# EAGLE design cube bottom 3 (EAGLE 9.5.1)
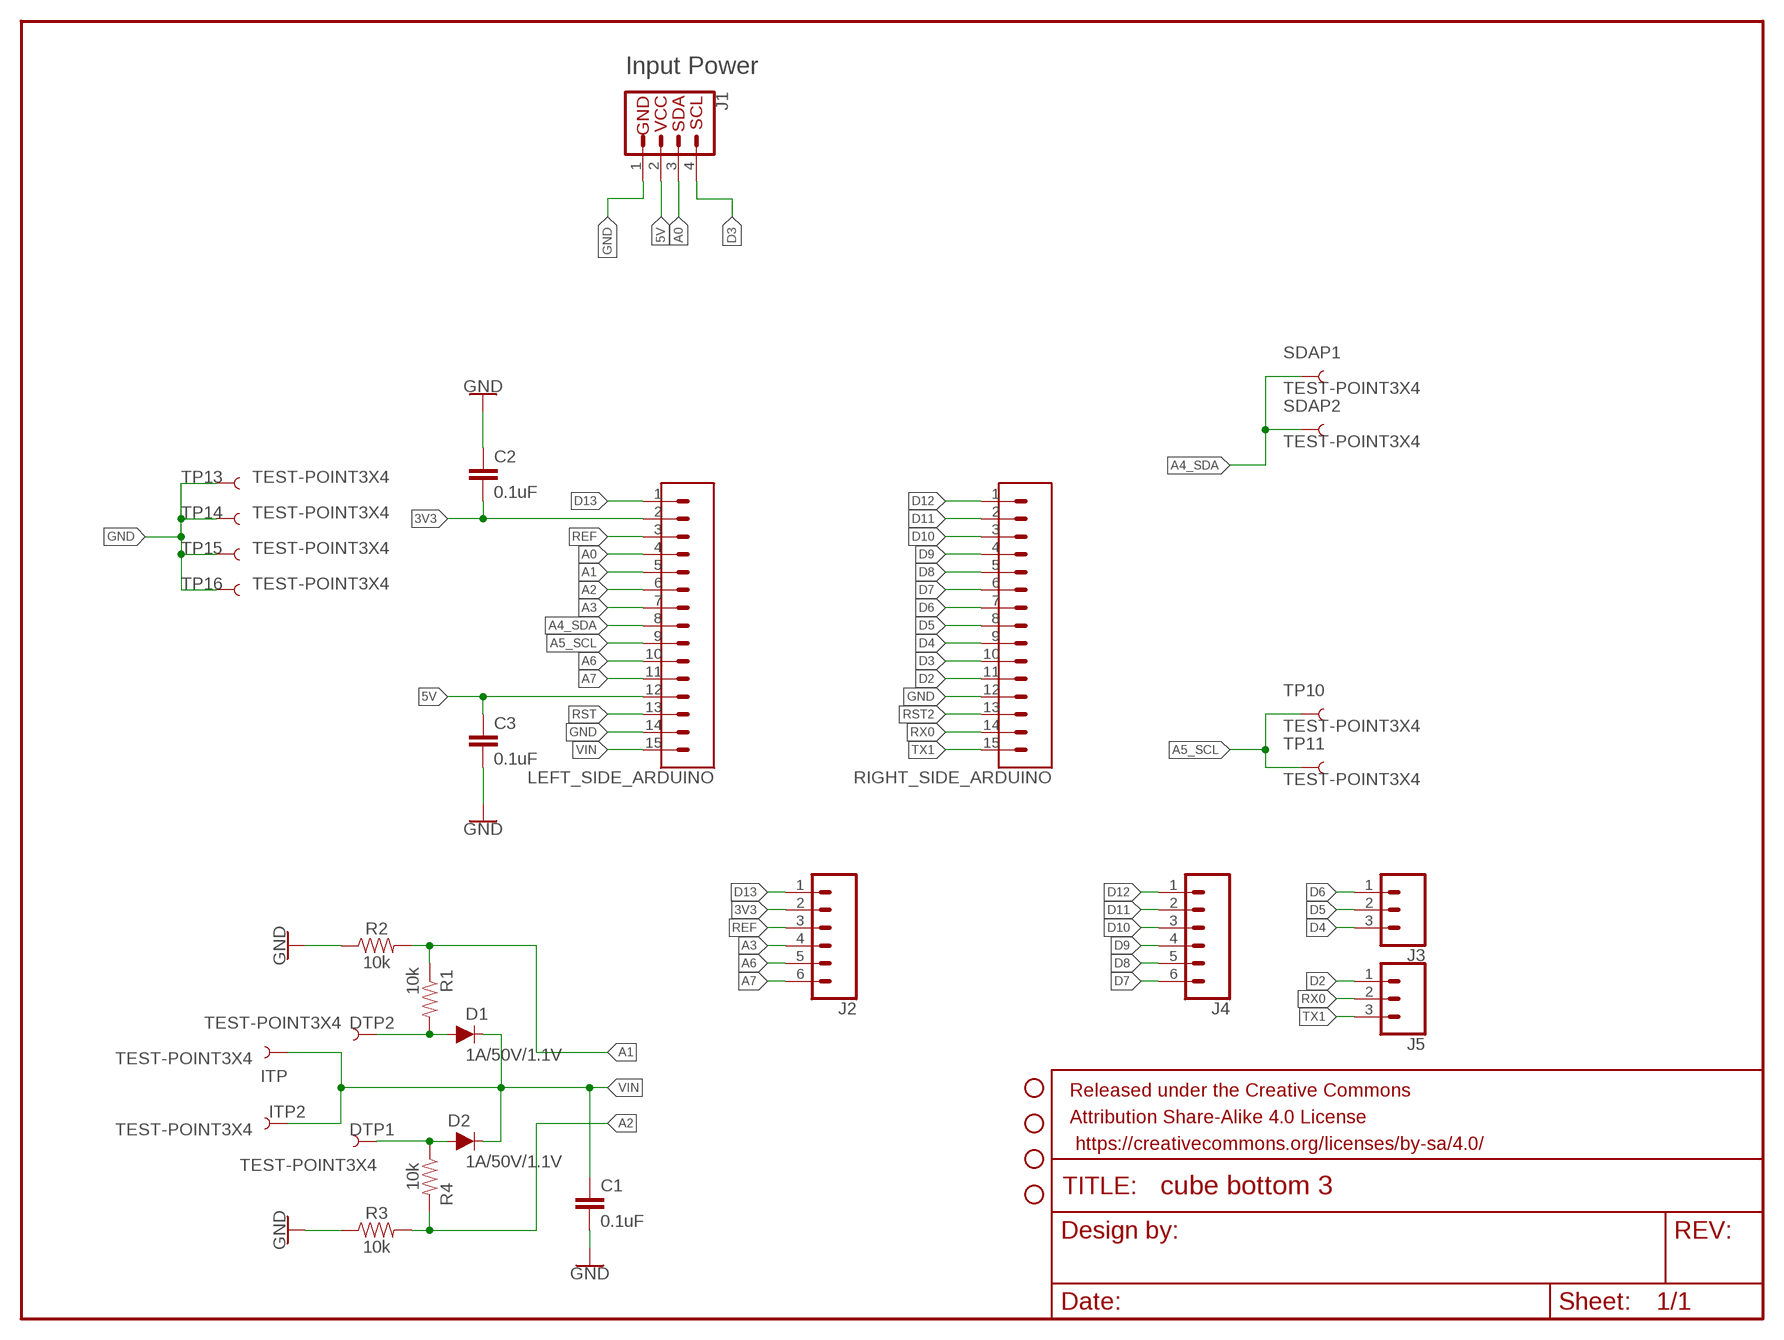
[diagram p0: schematic, sheet 1]

## Parts
C1  0.1uF  0.1UF-0603-25V-5%  [0603]
C2  0.1uF  0.1UF-0603-25V-(+80/-20%)  [0603]
C3  0.1uF  0.1UF-0603-25V-(+80/-20%)  [0603]
D1  1A/50V/1.1V  DIODE-PTH  [DIODE-1N4001]
D2  1A/50V/1.1V  DIODE-PTH  [DIODE-1N4001]
DTP1  TEST-POINT3X4  [PAD.03X.04]
DTP2  TEST-POINT3X4  [PAD.03X.04]
FRAME1  FRAME-LETTERNO_PACKAGE  [DUMMY]
H1  STAND-OFF  [STAND-OFF]
H2  STAND-OFF  [STAND-OFF]
H3  STAND-OFF  [STAND-OFF]
H4  STAND-OFF  [STAND-OFF]
ITP  TEST-POINT3X4  [PAD.03X.04]
ITP2  TEST-POINT3X4  [PAD.03X.04]
J1  QWIIC_CONNECTORJS-1MM  [1X04_1MM_RA]
J2  CONN_06SILK_FEMALE_PTH  [1X06]
J3  CONN_03  [1X03]
J4  CONN_06SILK_FEMALE_PTH  [1X06]
J5  CONN_03  [1X03]
LEFT_SIDE_ARDUINO  CONN_06SMD_MALE  [1X15_SMD_MALE]
R1  10k  10KOHM-0603-1/10W-1%  [0603]
R2  10k  10KOHM-0603-1/10W-1%  [0603]
R3  10k  10KOHM-0603-1/10W-1%  [0603]
R4  10k  10KOHM-0603-1/10W-1%  [0603]
RIGHT_SIDE_ARDUINO  CONN_06SMD_MALE  [1X15_SMD_MALE]
SDAP1  TEST-POINT3X4  [PAD.03X.04]
SDAP2  TEST-POINT3X4  [PAD.03X.04]
TP10  TEST-POINT3X4  [PAD.03X.04]
TP11  TEST-POINT3X4  [PAD.03X.04]
TP13  TEST-POINT3X4  [PAD.03X.04]
TP14  TEST-POINT3X4  [PAD.03X.04]
TP15  TEST-POINT3X4  [PAD.03X.04]
TP16  TEST-POINT3X4  [PAD.03X.04]

## Nets
3V3: C2.2 J2.2 LEFT_SIDE_ARDUINO.2
5V: C3.1 J1.2(VCC) LEFT_SIDE_ARDUINO.12
A0: J1.3(SDA) LEFT_SIDE_ARDUINO.4
A1: LEFT_SIDE_ARDUINO.5 R1.1 R2.2
A2: LEFT_SIDE_ARDUINO.6 R3.2 R4.2
A3: J2.4 LEFT_SIDE_ARDUINO.7
A4_SDA: LEFT_SIDE_ARDUINO.8 SDAP1.P$1 SDAP2.P$1
A5_SCL: LEFT_SIDE_ARDUINO.9 TP10.P$1 TP11.P$1
A6: J2.5 LEFT_SIDE_ARDUINO.10
A7: J2.6 LEFT_SIDE_ARDUINO.11
D2: J5.1 RIGHT_SIDE_ARDUINO.11
D3: J1.4(SCL) RIGHT_SIDE_ARDUINO.10
D4: J3.3 RIGHT_SIDE_ARDUINO.9
D5: J3.2 RIGHT_SIDE_ARDUINO.8
D6: J3.1 RIGHT_SIDE_ARDUINO.7
D7: J4.6 RIGHT_SIDE_ARDUINO.6
D8: J4.5 RIGHT_SIDE_ARDUINO.5
D9: J4.4 RIGHT_SIDE_ARDUINO.4
D10: J4.3 RIGHT_SIDE_ARDUINO.3
D11: J4.2 RIGHT_SIDE_ARDUINO.2
D12: J4.1 RIGHT_SIDE_ARDUINO.1
D13: J2.1 LEFT_SIDE_ARDUINO.1
DTP1: D2.A DTP1.P$1 R4.1
DTP2: D1.A DTP2.P$1 R1.2
GND: C1.2 C2.1 C3.2 J1.1(GND) LEFT_SIDE_ARDUINO.14 R2.1 R3.1 RIGHT_SIDE_ARDUINO.12 TP13.P$1 TP14.P$1 TP15.P$1 TP16.P$1
REF: J2.3 LEFT_SIDE_ARDUINO.3
RST: LEFT_SIDE_ARDUINO.13
RST2: RIGHT_SIDE_ARDUINO.13
RX0: J5.2 RIGHT_SIDE_ARDUINO.14
TX1: J5.3 RIGHT_SIDE_ARDUINO.15
VIN: C1.1 D1.C D2.C ITP2.P$1 ITP.P$1 LEFT_SIDE_ARDUINO.15

## Notes on the sheet
- Input Power

## Library data of the parts
C1 = SparkFun-Capacitors:0.1UF: 0.1µF ceramic capacitors A capacitor is a passive two-terminal electrical component used to store electrical energy temporarily in an electric field.; PROD_ID: CAP-08604
C2 C3 = SparkFun-Capacitors:0.1UF: 0.1µF ceramic capacitors A capacitor is a passive two-terminal electrical component used to store electrical energy temporarily in an electric field.; PROD_ID: CAP-00810
D1 D2 = SparkFun-DiscreteSemi:DIODE: Diode These are standard reverse protection diodes and small signal diodes. SparkFun Products: SparkFun SparkPunk Sound Kit <https://www.sparkfun.com/products/11177> SparkFun ESP8266 Thing <https://www.sparkfun.com/products/13231>; PROD_ID: DIO-09176
DTP1 DTP2 ITP ITP2 SDAP1 SDAP2 TP10 TP11 TP13-TP16 = SparkFun-Connectors:TEST-POINT: SparkFun Test Points Bare copper test points for troubleshooting or In-Circuit-Testing. These are used by our Production team for verifying production board runs using pogo-pins on test beds. SparkFun Products: SparkFun LSM9DS1 Breakout <https://www.sparkfun.com/products/13284> SparkFun PSOC <https://www.sparkfun.com/products/13714> SparkFun Load Cell Amplifier <https://www.sparkfun.com/products/13879>
FRAME1 = SparkFun-Aesthetics:FRAME-LETTER: Schematic Frame - Letter Standard 8.5x11 US Letter frame; DESIGNER: Nobody; VERSION: v01
H1-H4 = SparkFun-Hardware:STAND-OFF: Stand Off Drill holes for mechanically mounting via screws, standoffs, etc. Note: Use the keepout ring to avoid running the screw head into surrounding components. Variant Overviews STAND-OFF - Mechanical footprint for a #4 phillips button head screw. STAND-OFF-TIGHT - Mechanical footprint for a #4 phillips button head screw, Example SparkFun Products Screw - Phillips Head (1/4", 4-40, 10 pack) <https://www.sparkfun.com/products/10453> (PRT-10453) Screw - Phillips Head (1/2", 4-40, 10 pack) <https://www.sparkfun.com/products/10452> (PRT-10452) Screw - Phillips Head (3/4", 4-40, 10 pack) <https://www.sparkfun.com/products/10451> (PRT-10451) Screw - Phillips Head (1", 4-40, 10 pack) <https://www.sparkfun.com/products/10450> (PRT-10450)
J1 = SparkFun-Connectors:QWIIC_CONNECTOR: SparkFun I2C Standard Qwiic Connector An SMD 1mm pitch JST connector makes it easy and quick (get it? Qwiic?) to connect I2C devices to each other. The Qwiic system <http://www.sparkfun.com/qwiic> enables fast and solderless connection between popular platforms and various sensors and actuators. We carry 200mm <https://www.sparkfun.com/products/14204>, 100mm <https://www.sparkfun.com/products/14205>, 50mm <https://www.sparkfun.com/products/14206>, and breadboard friendly <https://www.sparkfun.com/products/14207> Qwiic cables. We also offer 10 pcs strips <https://www.sparkfun.com/products/14323> the SMD connectors.
J2 J4 = SparkFun-Connectors:CONN_06: Multi connection point. Often used as Generic Header-pin footprint for 0.1 inch spaced/style header connections On any of the 0.1 inch spaced packages, you can populate with these: Break Away Headers - Straight <https://www.sparkfun.com/products/116> (PRT-00116) Break Away Male Headers - Right Angle <https://www.sparkfun.com/products/553> (PRT-00553) Female Headers <https://www.sparkfun.com/products/115> (PRT-00115) Break Away Headers - Machine Pin <https://www.sparkfun.com/products/117> (PRT-00117) Break Away Female Headers - Swiss Machine Pin <https://www.sparkfun.com/products/743> (PRT-00743) Arduino Stackable Header - 6 Pin <https://www.sparkfun.com/products/9280> (PRT-09280) For SCREWTERMINALS and SPRING TERMINALS visit here: Screw Terimnals on SparkFun.com <https://www.sparkfun.com/search/results?term=Screw+Terminals> (5mm/3.5mm/2.54mm spacing) This device is also useful as a general connection point to wire up your design to another part of your project. Our various solder wires solder well into these plated through hole pads. Hook-Up Wire - Assortment (Stranded, 22 AWG) <https://www.sparkfun.com/products/11375> (PRT-11375) Hook-Up Wire - Assortment (Solid Core, 22 AWG) <https://www.sparkfun.com/products/11367> (PRT-11367) View the entire wire category on our website here <https://www.sparkfun.com/categories/141>; PROD_ID: CONN-08437
J3 J5 = SparkFun-Connectors:CONN_03: Multi connection point. Often used as Generic Header-pin footprint for 0.1 inch spaced/style header connections On any of the 0.1 inch spaced packages, you can populate with these: Break Away Headers - Straight <https://www.sparkfun.com/products/116> (PRT-00116) Break Away Male Headers - Right Angle <https://www.sparkfun.com/products/553> (PRT-00553) Female Headers <https://www.sparkfun.com/products/115> (PRT-00115) Break Away Headers - Machine Pin <https://www.sparkfun.com/products/117> (PRT-00117) Break Away Female Headers - Swiss Machine Pin <https://www.sparkfun.com/products/743> (PRT-00743) Stackable Header - 3 Pin (Female, 0.1") <https://www.sparkfun.com/products/13875> (PRT-13875) For SCREWTERMINALS and SPRING TERMINALS visit here: Screw Terimnals on SparkFun.com <https://www.sparkfun.com/search/results?term=Screw+Terminals> (5mm/3.5mm/2.54mm spacing) This device is also useful as a general connection point to wire up your design to another part of your project. Our various solder wires solder well into these plated through hole pads. Hook-Up Wire - Assortment (Stranded, 22 AWG) <https://www.sparkfun.com/products/11375> (PRT-11375) Hook-Up Wire - Assortment (Solid Core, 22 AWG) <https://www.sparkfun.com/products/11367> (PRT-11367) View the entire wire category on our website here <https://www.sparkfun.com/categories/141> Special notes: Molex polarized connector foot print use with SKU : PRT-08232 with associated crimp pins and housings.
LEFT_SIDE_ARDUINO RIGHT_SIDE_ARDUINO = capstone footprints:CONN_06: Multi connection point. Often used as Generic Header-pin footprint for 0.1 inch spaced/style header connections On any of the 0.1 inch spaced packages, you can populate with these: Break Away Headers - Straight <https://www.sparkfun.com/products/116> (PRT-00116) Break Away Male Headers - Right Angle <https://www.sparkfun.com/products/553> (PRT-00553) Female Headers <https://www.sparkfun.com/products/115> (PRT-00115) Break Away Headers - Machine Pin <https://www.sparkfun.com/products/117> (PRT-00117) Break Away Female Headers - Swiss Machine Pin <https://www.sparkfun.com/products/743> (PRT-00743) Arduino Stackable Header - 6 Pin <https://www.sparkfun.com/products/9280> (PRT-09280) For SCREWTERMINALS and SPRING TERMINALS visit here: Screw Terimnals on SparkFun.com <https://www.sparkfun.com/search/results?term=Screw+Terminals> (5mm/3.5mm/2.54mm spacing) This device is also useful as a general connection point to wire up your design to another part of your project. Our various solder wires solder well into these plated through hole pads. Hook-Up Wire - Assortment (Stranded, 22 AWG) <https://www.sparkfun.com/products/11375> (PRT-11375) Hook-Up Wire - Assortment (Solid Core, 22 AWG) <https://www.sparkfun.com/products/11367> (PRT-11367) View the entire wire category on our website here <https://www.sparkfun.com/categories/141>; PROD_ID: CONN-11293
R1-R4 = SparkFun-Resistors:10KOHM: 10kΩ resistor A resistor is a passive two-terminal electrical component that implements electrical resistance as a circuit element. Resistors act to reduce current flow, and, at the same time, act to lower voltage levels within circuits. - Wikipedia; PROD_ID: RES-00824

## Board
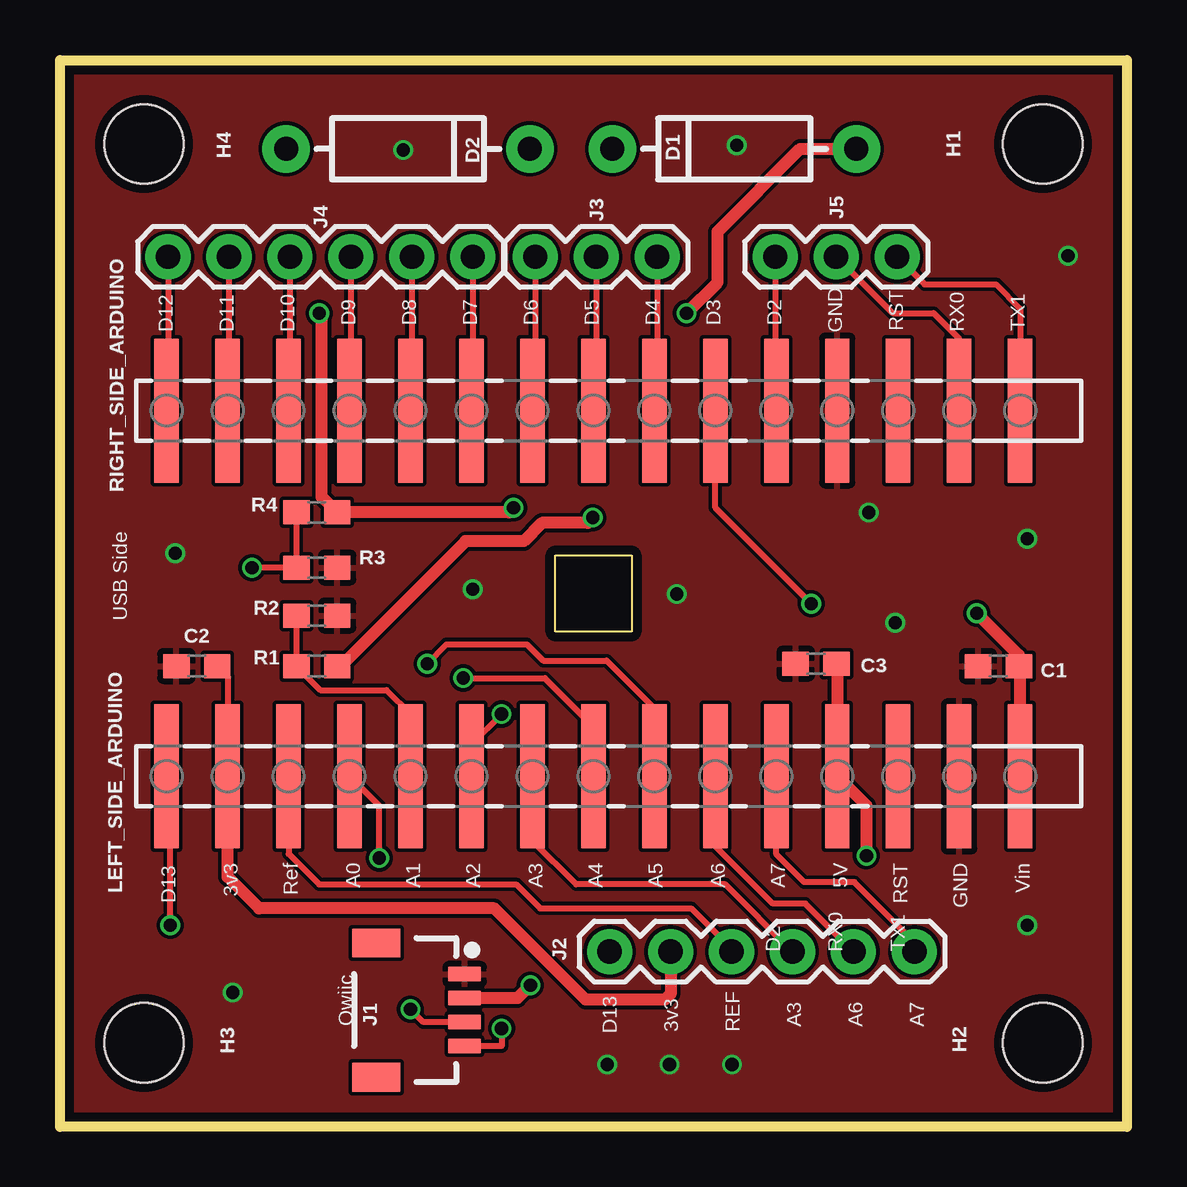
[diagram p1: board, top side]
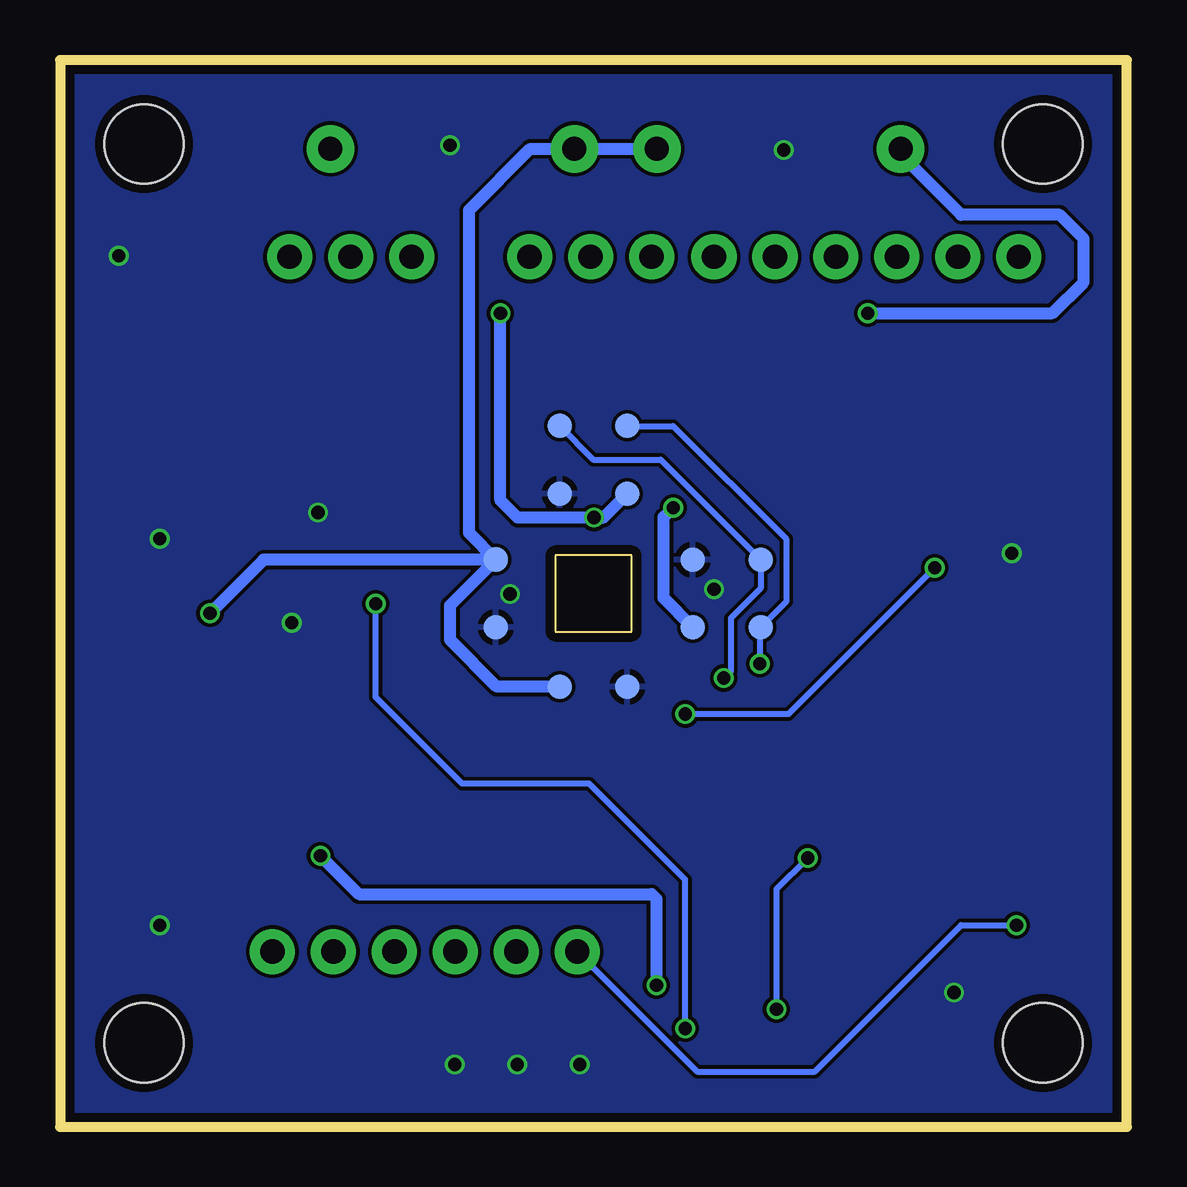
[diagram p2: board, bottom side, seen from below]

Size 44.45 x 44.45 mm. Coordinates in mm from the lower left corner, seen from the top.
Outline: 0,0 0,44.45 44.45,44.45 44.45,0 0,0
Outline: 20.64,23.81 23.81,23.81 23.81,20.64 20.64,20.64 20.64,23.81
Copper layers (1*16): Top 0.035559375mm / dielectric 1.6mm / Bottom 0.035559375mm
Design rules "OSH_2Layer": minimum track width 6mil, minimum drill 10mil, track to track 6mil, track to pad 6mil, pad to pad 6mil, via to via 6mil, smd to smd 6mil, copper to edge 15mil, drill to drill 6mil, minimum pad ring 5mil, minimum via ring 5mil, stop-mask expansion 2.5mil, vias tented up to drill 0mil, thermal gap 10mil

### Footprints (pad centres in the part's own frame; a part is rotated, then mirrored left to right if it is on the bottom)
0603 = smd 1.1 x 1: 1 -0.85,0; 2 0.85,0
DIODE-1N4001 = drill 1 pad 1.981: A -5.08,0; C 5.08,0
PAD.03X.04 = smd 1.016 x 1.016: P$1 0,0
STAND-OFF = hole 3.302: 0,0
1X04_1MM_RA = smd 0.6 x 1.35: 1 -1.5,0; 2 -0.5,0; 3 0.5,0; 4 1.5,0 | smd 1.2 x 2: NC1 2.8,-3.675; NC2 -2.8,-3.675
1X06 = drill 1.016 pad 1.88: 1 0,0; 2 2.54,0; 3 5.08,0; 4 7.62,0; 5 10.16,0; 6 12.7,0
1X03 = drill 1.016 pad 1.88: 1 0,0; 2 2.54,0; 3 5.08,0
1X15_SMD_MALE = smd 1.02 x 6: 1 0,0; 2 2.54,0; 3 5.08,0; 4 7.62,0; 5 10.16,0; 6 12.7,0; 7 15.24,0; 8 17.78,0; 9 20.32,0; 10 22.86,0; 11 25.4,0; 12 27.94,0; 13 30.48,0; 14 33.02,0; 15 35.56,0

### Placement (x,y rotation side)
C1  39.1,19.2 180 top
C2  5.7,19.2 0 top
C3  31.5,19.3 180 top
D1  28.1,40.75 180 top
D2  14.5,40.75 0 top
DTP1  18.08,20.81 0 bottom
DTP2  20.81,26.38 0 bottom
FRAME1  0,0 0 top
H1  40.95,40.95 0 top
H2  40.95,3.5 0 top
H3  3.5,3.5 0 top
H4  3.5,40.95 0 top
ITP  26.29,23.64 0 bottom
ITP2  23.64,18.34 0 bottom
J1  16.86,4.86 270 top
J2  22.9,7.3 0 top
J3  19.8,36.25 0 top
J4  4.5,36.25 0 top
J5  29.8,36.25 0 top
LEFT_SIDE_ARDUINO  4.45,14.61 0 top
R1  10.7,19.2 0 top
R2  10.7,21.3 180 top
R3  10.7,23.3 180 top
R4  10.7,25.6 180 top
RIGHT_SIDE_ARDUINO  4.45,29.84 0 top
SDAP1  23.64,29.2 0 bottom
SDAP2  15.26,23.64 0 bottom
TP10  20.81,29.2 0 bottom
TP11  15.26,20.81 0 bottom
TP13  18.08,23.64 0 bottom
TP14  20.81,18.34 0 bottom
TP15  26.29,20.81 0 bottom
TP16  23.64,26.38 0 bottom

### Tracks (layer width: path | path; a pad name or v marks a point on that pad's centre or on a via)
3V3
  Top 0.254: C2.2 6.99,18.77 LEFT_SIDE_ARDUINO.2
  Top 0.508: J2.2 25.44,5.54 25.2,5.3 21.9,5.3 18.1,9.1 8.3,9.1 6.99,10.41 LEFT_SIDE_ARDUINO.2
5V  (via drill 0.55)
  Top 0.508: C3.1 32.38,19.27 LEFT_SIDE_ARDUINO.12 33.6,13.39 v33.6,11.3 | v19.6,5.9 19.06,5.36 J1.2
  Bottom 0.508: v33.6,11.3 32,9.7 19.8,9.7 19.6,9.5 v19.6,5.9
A0  (via drill 0.55)
  Top 0.254: J1.3 15.14,4.36 v14.6,4.9 | v13.3,11.2 13.3,13.37 LEFT_SIDE_ARDUINO.4
  Bottom 0.254: v13.3,11.2 14.6,9.9 v14.6,4.9
A1
  Top 0.254: R2.2 R1.1 10.85,18.2 13.6,18.2 14.61,17.2 LEFT_SIDE_ARDUINO.5
A2  (via drill 0.55)
  Top 0.254: R4.2 R3.2 v8,23.3 | v18.4,17.2 17.14,15.95 LEFT_SIDE_ARDUINO.6
  Bottom 0.254: v8,23.3 14.1,17.2 v18.4,17.2
A3
  Top 0.254: J2.4 27.72,10.1 21.5,10.1 19.68,11.91 LEFT_SIDE_ARDUINO.7
A4_SDA  (via drill 0.55)
  Top 0.254: v16.8,18.7 20.2,18.7 22.23,16.68 LEFT_SIDE_ARDUINO.8
  Bottom 0.254: SDAP1.P$1 22.23,27.8 19.42,27.8 SDAP2.P$1 15.26,22.44 16.5,21.19 16.5,19 v16.8,18.7
A5_SCL  (via drill 0.55)
  Top 0.254: v15.3,19.3 16.1,20.1 19.45,20.1 20.13,19.42 22.78,19.42 24.77,17.43 LEFT_SIDE_ARDUINO.9
  Bottom 0.254: TP10.P$1 18.9,29.2 14.2,24.5 14.2,21.87 TP11.P$1 15.3,20.77 v15.3,19.3
A6
  Top 0.254: J2.5 31.06,9.3 29.7,9.3 27.3,11.7 LEFT_SIDE_ARDUINO.10
A7
  Top 0.254: J2.6 35.6,7.7 33.1,10.2 31,10.2 29.84,11.36 LEFT_SIDE_ARDUINO.11
D2
  Top 0.254: J5.1 29.8,29.89 RIGHT_SIDE_ARDUINO.11
D3  (via drill 0.55)
  Top 0.254: v18.4,4.1 18.4,3.36 J1.4 | v31.3,21.8 27.3,25.8 RIGHT_SIDE_ARDUINO.10
  Bottom 0.254: v18.4,4.1 18.4,10.3 22.4,14.3 27.7,14.3 31.3,17.9 v31.3,21.8
D4
  Top 0.254: J3.3 24.88,29.96 RIGHT_SIDE_ARDUINO.9
D5
  Top 0.254: J3.2 22.34,29.96 RIGHT_SIDE_ARDUINO.8
D6
  Top 0.254: J3.1 19.8,29.96 RIGHT_SIDE_ARDUINO.7
D7
  Top 0.254: J4.6 17.2,29.9 RIGHT_SIDE_ARDUINO.6
D8
  Top 0.254: J4.5 14.66,29.9 RIGHT_SIDE_ARDUINO.5
D9
  Top 0.254: J4.4 12.12,29.9 RIGHT_SIDE_ARDUINO.4
D10
  Top 0.254: J4.3 9.58,29.9 RIGHT_SIDE_ARDUINO.3
D11
  Top 0.254: J4.2 7.04,29.9 RIGHT_SIDE_ARDUINO.2
D12
  Top 0.254: J4.1 4.5,29.9 RIGHT_SIDE_ARDUINO.1
D13  (via drill 0.55)
  Top 0.254: v4.6,8.4 4.6,14.45 LEFT_SIDE_ARDUINO.1
  Bottom 0.254: J2.1 17.9,2.3 13,2.3 6.9,8.4 v4.6,8.4
DTP1  (via drill 0.55)
  Top 0.508: v18.9,25.8 18.7,25.6 R4.1 10.9,26.25 10.9,33.8 v10.8,33.9
  Bottom 0.508: DTP1.P$1 19.3,22.04 19.3,25.4 v18.9,25.8 | v10.8,33.9 3.1,33.9 1.8,35.2 1.8,37 2.8,38 6.9,38 9.42,40.52 D2.A
DTP2  (via drill 0.55)
  Top 0.508: v22.2,25.38 21.98,25.16 20.08,25.16 19.32,24.4 16.9,24.4 11.7,19.2 R1.2 | v26.1,33.9 27.4,35.2 27.4,37.3 30.85,40.75 D1.A
  Bottom 0.508: DTP2.P$1 21.81,25.38 v22.2,25.38 25.38,25.38 26.1,26.1 v26.1,33.9
GND  (via drill 0.55)
  other vias: 42,36.3 4.8,23.9 22.8,2.6 25.4,2.6 28,2.6 40.3,8.4 40.3,24.5 33.7,25.6 34.8,21 14.3,40.7 28.2,40.9 7.2,5.6 17.2,22.4 25.7,22.2
  pour Top: -0.1,44.5 44.5,44.5 44.5,-0.1 -0.1,-0.1
  pour Bottom: -0.1,44.5 44.5,44.5 44.5,-0.1 -0.1,-0.1
REF
  Top 0.254: LEFT_SIDE_ARDUINO.3 9.53,11.38 10.8,10.1 19,10.1 20,9.1 26.3,9.1 27.98,7.42 J2.3
RX0
  Top 0.254: J5.2 34.69,33.9 36.4,33.9 37.47,32.84 RIGHT_SIDE_ARDUINO.14
TX1
  Top 0.254: J5.3 36.03,35.1 39,35.1 40.01,34.09 RIGHT_SIDE_ARDUINO.15
VIN  (via drill 0.55)
  Top 0.508: v38.2,21.4 39.95,19.65 C1.1 40.01,19.14 LEFT_SIDE_ARDUINO.15
  Bottom 0.508: ITP2.P$1 26.24,18.34 28.2,20.3 28.2,21.73 ITP.P$1 | ITP.P$1 27.4,24.74 27.4,38.2 24.85,40.75 D1.C D2.C | ITP.P$1 35.96,23.64 v38.2,21.4

### Text on the board
tPlace: D12 | D11 | D10 | D9 | D8 | D7 | D6 | D5 | D4 | D3 | D2 | GND | RST | RX0 | TX1 | USB Side | D13 | 3v3 | Ref | A0 | A1 | A2 | A3 | A4 | A5 | A6 | A7 | 5V | RST | GND | Vin | D2 | RX0 | TX1 | Qwiic | D13 | 3v3 | REF | A3 | A6 | A7
Notes: Please Drill out center square in Milling layer (layer 45). / This should leave a 1/8"x1/8" square hole in the center of the board.